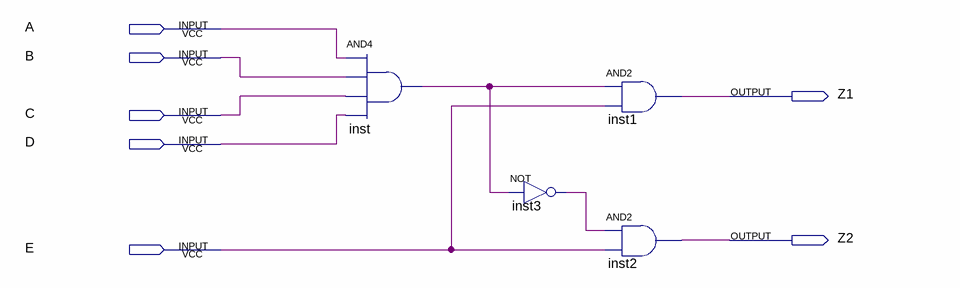
[diagram p0: schematic sheet]
// Quartus schematic Block1.bdf as structural Verilog: 4 symbols, 7 pins
module Block1 (
  input  A,
  input  B,
  input  C,
  input  D,
  input  E,
  output Z1,
  output Z2
);

  wire inst3_out, inst_out;

  and inst (inst_out, A, B, C, D);
  not inst3 (inst3_out, inst_out);
  and inst1 (Z1, inst_out, E);
  and inst2 (Z2, inst3_out, E);
endmodule
